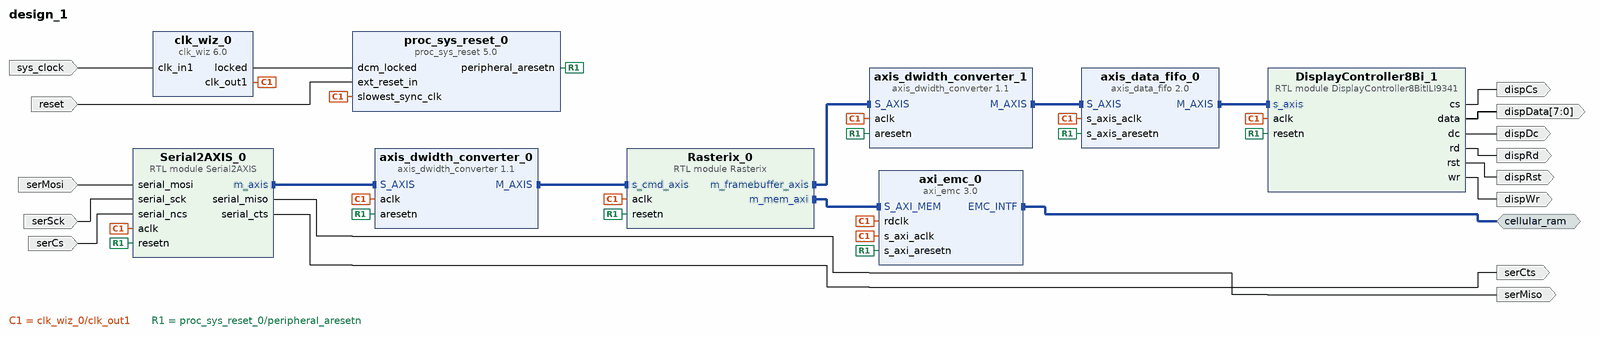
[diagram p0: block diagram of the top level]
# Vivado block design design_1, xc7a35tcpg236-1, Vivado 2020.1
create_bd_design design_1

create_bd_intf_port -mode Master -vlnv xilinx.com:interface:emc_rtl:1.0 cellular_ram
create_bd_port -dir I -type rst reset
set_property -dict {CONFIG.POLARITY ACTIVE_HIGH} [get_bd_ports reset]
create_bd_port -dir O -from 7 -to 0 dispData
create_bd_port -dir O dispRd
create_bd_port -dir O dispWr
create_bd_port -dir O dispDc
create_bd_port -dir O dispRst
create_bd_port -dir O dispCs
create_bd_port -dir I serMosi
create_bd_port -dir I serSck
create_bd_port -dir I serCs
create_bd_port -dir O serMiso
create_bd_port -dir O serCts
create_bd_port -dir I -type clk sys_clock
set_property -dict {CONFIG.FREQ_HZ 12000000 CONFIG.PHASE 0.000} [get_bd_ports sys_clock]

create_bd_cell -type ip -vlnv xilinx.com:ip:axi_emc:3.0 axi_emc_0
set_property -dict [list \
  CONFIG.C_MEM0_TYPE 1 \
  CONFIG.C_MEM0_WIDTH 8 \
  CONFIG.C_S_AXI_MEM_DATA_WIDTH 64 \
  CONFIG.EMC_BOARD_INTERFACE cellular_ram \
  CONFIG.USE_BOARD_FLOW true \
] [get_bd_cells axi_emc_0]
create_bd_cell -type ip -vlnv xilinx.com:ip:clk_wiz:6.0 clk_wiz_0
set_property -dict [list \
  CONFIG.AXI_DRP false \
  CONFIG.CLKOUT1_DRIVES BUFG \
  CONFIG.CLKOUT1_JITTER 479.872 \
  CONFIG.CLKOUT1_PHASE_ERROR 668.310 \
  CONFIG.CLKOUT1_REQUESTED_OUT_FREQ 100 \
  CONFIG.CLKOUT2_REQUESTED_OUT_FREQ 100.000 \
  CONFIG.CLKOUT3_REQUESTED_OUT_FREQ 100.000 \
  CONFIG.CLKOUT4_REQUESTED_OUT_FREQ 100.000 \
  CONFIG.CLKOUT5_REQUESTED_OUT_FREQ 100.000 \
  CONFIG.CLKOUT6_REQUESTED_OUT_FREQ 100.000 \
  CONFIG.CLKOUT7_REQUESTED_OUT_FREQ 100.000 \
  CONFIG.CLK_IN1_BOARD_INTERFACE sys_clock \
  CONFIG.FEEDBACK_SOURCE FDBK_AUTO \
  CONFIG.JITTER_SEL Min_O_Jitter \
  CONFIG.MMCM_BANDWIDTH HIGH \
  CONFIG.MMCM_CLKFBOUT_MULT_F 62.500 \
  CONFIG.MMCM_CLKOUT0_DIVIDE_F 7.500 \
  CONFIG.MMCM_COMPENSATION ZHOLD \
  CONFIG.PHASE_DUTY_CONFIG false \
  CONFIG.RESET_BOARD_INTERFACE Custom \
  CONFIG.USE_BOARD_FLOW true \
  CONFIG.USE_DYN_PHASE_SHIFT false \
  CONFIG.USE_DYN_RECONFIG false \
  CONFIG.USE_FREQ_SYNTH true \
  CONFIG.USE_RESET false \
] [get_bd_cells clk_wiz_0]
create_bd_cell -type ip -vlnv xilinx.com:ip:proc_sys_reset:5.0 proc_sys_reset_0
set_property -dict {CONFIG.RESET_BOARD_INTERFACE reset CONFIG.USE_BOARD_FLOW true} [get_bd_cells proc_sys_reset_0]
create_bd_cell -type module -reference Rasterix Rasterix_0
set_property -dict [list \
  CONFIG.CMD_STREAM_WIDTH 64 \
  CONFIG.FRAMEBUFFER_SIZE_BYTES 15 \
  CONFIG.FRAMEBUFFER_SUB_PIXEL_WIDTH 5 \
  CONFIG.STRB_WIDTH 8 \
  CONFIG.TMU_COUNT 1 \
] [get_bd_cells Rasterix_0]
create_bd_cell -type ip -vlnv xilinx.com:ip:axis_dwidth_converter:1.1 axis_dwidth_converter_0
set_property -dict {CONFIG.M_TDATA_NUM_BYTES 8 CONFIG.S_TDATA_NUM_BYTES 4} [get_bd_cells axis_dwidth_converter_0]
create_bd_cell -type ip -vlnv xilinx.com:ip:axis_dwidth_converter:1.1 axis_dwidth_converter_1
set_property -dict {CONFIG.S_TDATA_NUM_BYTES 8} [get_bd_cells axis_dwidth_converter_1]
create_bd_cell -type ip -vlnv xilinx.com:ip:axis_data_fifo:2.0 axis_data_fifo_0
set_property -dict {CONFIG.FIFO_DEPTH 16384 CONFIG.HAS_TLAST 0} [get_bd_cells axis_data_fifo_0]
create_bd_cell -type module -reference Serial2AXIS Serial2AXIS_0
set_property -dict {CONFIG.FIFO_SIZE 32768 CONFIG.FIFO_TRESHOLD 8192} [get_bd_cells Serial2AXIS_0]
create_bd_cell -type module -reference DisplayController8BitILI9341 DisplayController8Bi_1
set_property -dict {CONFIG.CLOCK_DIV 4 CONFIG.LANDSCAPE_CONFIG 1} [get_bd_cells DisplayController8Bi_1]

# ---- connections ----

connect_bd_intf_net [get_bd_intf_pins Rasterix_0/m_framebuffer_axis] [get_bd_intf_pins axis_dwidth_converter_1/S_AXIS]
connect_bd_intf_net [get_bd_intf_pins axis_dwidth_converter_0/M_AXIS] [get_bd_intf_pins Rasterix_0/s_cmd_axis]
connect_bd_intf_net [get_bd_intf_pins axis_dwidth_converter_0/S_AXIS] [get_bd_intf_pins Serial2AXIS_0/m_axis]
connect_bd_intf_net [get_bd_intf_ports cellular_ram] [get_bd_intf_pins axi_emc_0/EMC_INTF]
connect_bd_intf_net [get_bd_intf_pins Rasterix_0/m_mem_axi] [get_bd_intf_pins axi_emc_0/S_AXI_MEM]
connect_bd_intf_net [get_bd_intf_pins axis_dwidth_converter_1/M_AXIS] [get_bd_intf_pins axis_data_fifo_0/S_AXIS]
connect_bd_intf_net [get_bd_intf_pins axis_data_fifo_0/M_AXIS] [get_bd_intf_pins DisplayController8Bi_1/s_axis]
connect_bd_net [get_bd_pins clk_wiz_0/clk_out1] \
  [get_bd_pins axi_emc_0/rdclk] [get_bd_pins axi_emc_0/s_axi_aclk] [get_bd_pins proc_sys_reset_0/slowest_sync_clk] \
  [get_bd_pins Rasterix_0/aclk] [get_bd_pins axis_dwidth_converter_0/aclk] [get_bd_pins axis_dwidth_converter_1/aclk] \
  [get_bd_pins axis_data_fifo_0/s_axis_aclk] [get_bd_pins Serial2AXIS_0/aclk] [get_bd_pins DisplayController8Bi_1/aclk]
connect_bd_net [get_bd_pins proc_sys_reset_0/peripheral_aresetn] \
  [get_bd_pins axi_emc_0/s_axi_aresetn] [get_bd_pins Rasterix_0/resetn] [get_bd_pins axis_dwidth_converter_0/aresetn] \
  [get_bd_pins axis_dwidth_converter_1/aresetn] [get_bd_pins axis_data_fifo_0/s_axis_aresetn] \
  [get_bd_pins Serial2AXIS_0/resetn] [get_bd_pins DisplayController8Bi_1/resetn]
connect_bd_net [get_bd_pins clk_wiz_0/locked] [get_bd_pins proc_sys_reset_0/dcm_locked]
connect_bd_net [get_bd_pins Serial2AXIS_0/serial_miso] [get_bd_ports serMiso]
connect_bd_net [get_bd_pins Serial2AXIS_0/serial_cts] [get_bd_ports serCts]
connect_bd_net [get_bd_ports serMosi] [get_bd_pins Serial2AXIS_0/serial_mosi]
connect_bd_net [get_bd_ports serSck] [get_bd_pins Serial2AXIS_0/serial_sck]
connect_bd_net [get_bd_ports serCs] [get_bd_pins Serial2AXIS_0/serial_ncs]
connect_bd_net [get_bd_pins DisplayController8Bi_1/data] [get_bd_ports dispData]
connect_bd_net [get_bd_pins DisplayController8Bi_1/rd] [get_bd_ports dispRd]
connect_bd_net [get_bd_pins DisplayController8Bi_1/wr] [get_bd_ports dispWr]
connect_bd_net [get_bd_pins DisplayController8Bi_1/cs] [get_bd_ports dispCs]
connect_bd_net [get_bd_pins DisplayController8Bi_1/dc] [get_bd_ports dispDc]
connect_bd_net [get_bd_pins DisplayController8Bi_1/rst] [get_bd_ports dispRst]
connect_bd_net [get_bd_ports reset] [get_bd_pins proc_sys_reset_0/ext_reset_in]
connect_bd_net [get_bd_ports sys_clock] [get_bd_pins clk_wiz_0/clk_in1]

# ---- address map ----
assign_bd_address -offset 0x000000 -range 512K -target_address_space [get_bd_addr_spaces Rasterix_0/m_mem_axi] [get_bd_addr_segs axi_emc_0/S_AXI_MEM/Mem0]

validate_bd_design
save_bd_design
